# Altium project IMX6 DEV BOARD.PrjPcb (part 3 of 4)

## Sheet audio_codec.SchDoc
size A4; SheetNumber: 13; SheetTotal: 21
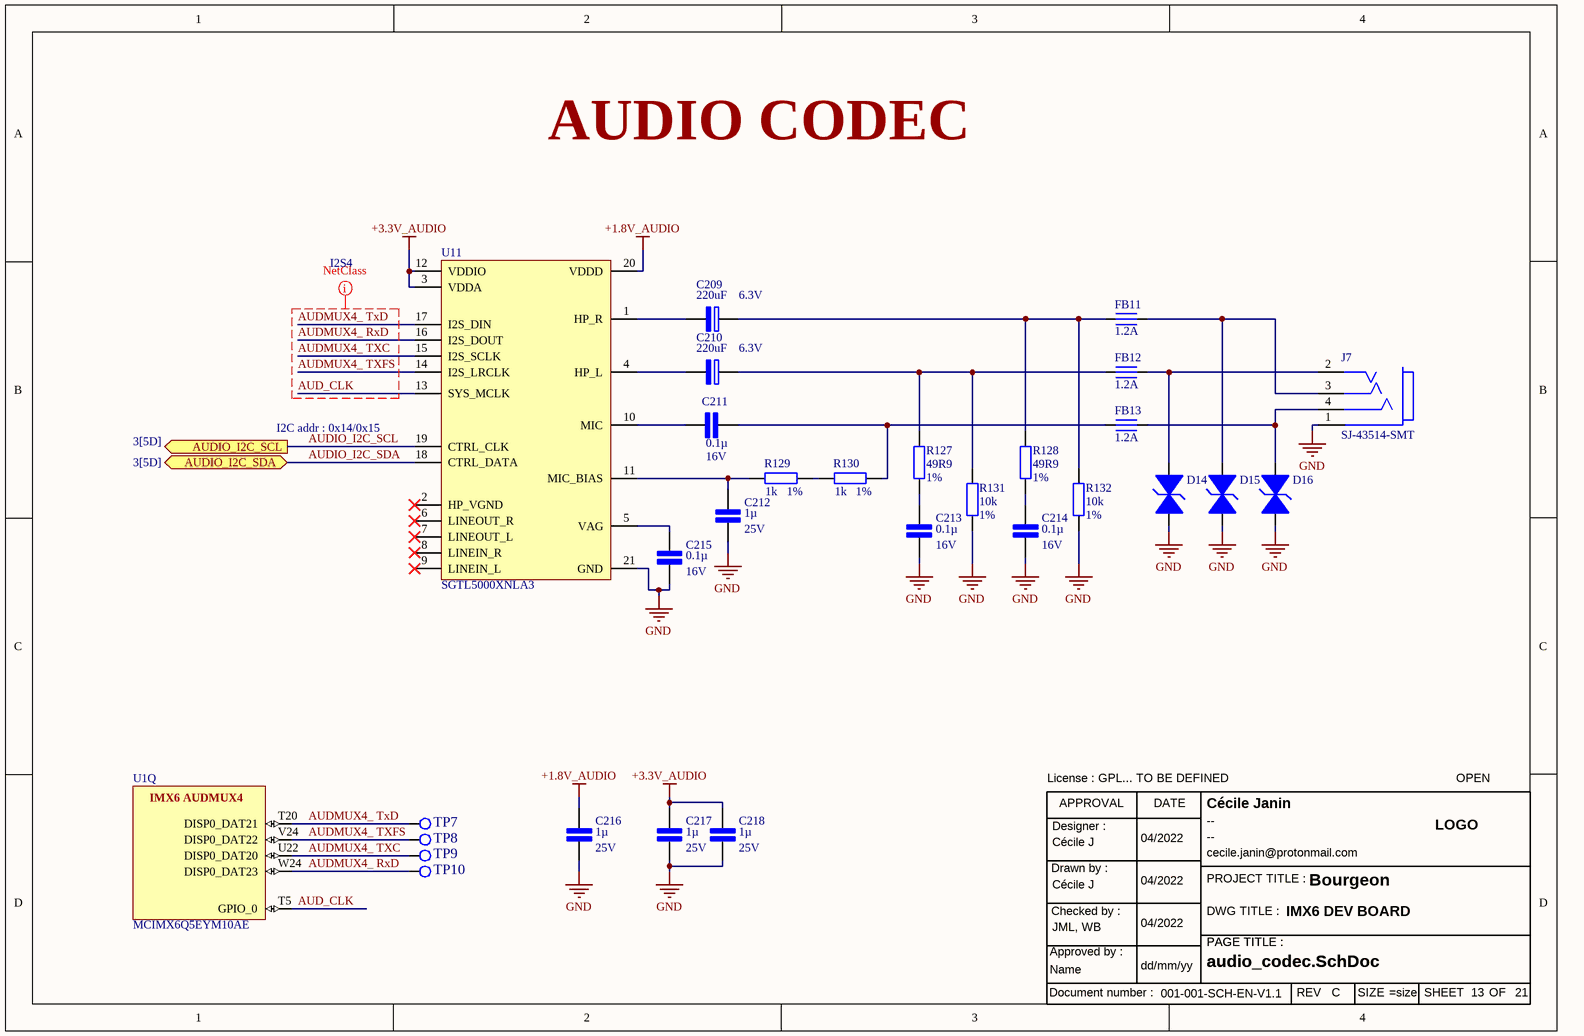
[diagram p15: audio_codec.SchDoc]

### Parts
C209  220uF  Rated Voltage (DC): 6.3V  [cap polymer wurth]
C210  220uF  Rated Voltage (DC): 6.3V  [cap polymer wurth]
C211  0.1µ  Tension du diélectrique: 16V  [Cap cer 0402/1005]
C212  1µ  Tension du diélectrique: 25V  [Cap cer 0402/1005]
C213  0.1µ  Tension du diélectrique: 16V  [Cap cer 0402/1005]
C214  0.1µ  Tension du diélectrique: 16V  [Cap cer 0402/1005]
C215  0.1µ  Tension du diélectrique: 16V  [Cap cer 0402/1005]
C216  1µ  Tension du diélectrique: 25V  [Cap cer 0402/1005]
C217  1µ  Tension du diélectrique: 25V  [Cap cer 0402/1005]
C218  1µ  Tension du diélectrique: 25V  [Cap cer 0402/1005]
D14  TVS 5V  [inductor 0402/1005]  (value not drawn)
D15  TVS 5V  [inductor 0402/1005]  (value not drawn)
D16  TVS 5V  [inductor 0402/1005]  (value not drawn)
FB11  1.2A  [inductor 0402/1005]
FB12  1.2A  [inductor 0402/1005]
FB13  1.2A  [inductor 0402/1005]
J7  SJ-43514-SMT  [Jack SJ-43514-SMT]
R127  49R9  pourcentage: 1%  [Res 0402/1005]
R128  49R9  pourcentage: 1%  [Res 0402/1005]
R129  1k  pourcentage: 1%  [Res 0402/1005]
R130  1k  pourcentage: 1%  [Res 0402/1005]
R131  10k  pourcentage: 1%  [Res 0402/1005]
R132  10k  pourcentage: 1%  [Res 0402/1005]
TB12  Title bloc ANSI modified  (value not drawn)
TP7  Test Point  [testpoint 1mm]  (value not drawn)
TP8  Test Point  [testpoint 1mm]  (value not drawn)
TP9  Test Point  [testpoint 1mm]  (value not drawn)
TP10  Test Point  [testpoint 1mm]  (value not drawn)
U1  MCIMX6Q5EYM10AE  [FRES-2197-01]  (part Q of 21)
U11  SGTL5000XNLA3  [QFN20]

### Ports
AUDIO_I2C_SCL (out, see 3[5D]), AUDIO_I2C_SDA (bidir, see 3[5D])

### Nets
+1.8V_AUDIO: C216.2 U11.20(VDDD)
+3.3V_AUDIO: C217.2 C218.2 U11.3(VDDA) U11.12(VDDIO)
GND: C212.1 C213.2 C214.2 C215.2 C216.1 C217.1 C218.1 D14.2 D15.2 D16.2 J7.1(sleeve) R131.1 R132.1 U11.21(GND)
AUD_CLK: U1.T5(GPIO_0) U11.13(SYS_MCLK)
AUDIO_I2C_SCL: U11.19(CTRL_CLK) ; port AUDIO_I2C_SCL
AUDIO_I2C_SDA: U11.18(CTRL_DATA) ; port AUDIO_I2C_SDA
AUDMUX4_ RxD: TP10.1(tp) U1.W24(DISP0_DAT23) U11.16(I2S_DOUT)
AUDMUX4_ TXC: TP9.1(tp) U1.U22(DISP0_DAT20) U11.15(I2S_SCLK)
AUDMUX4_ TxD: TP7.1(tp) U1.T20(DISP0_DAT21) U11.17(I2S_DIN)
AUDMUX4_ TXFS: TP8.1(tp) U1.V24(DISP0_DAT22) U11.14(I2S_LRCLK)
NetC209_1: C209.1(P) FB11.1 R128.2 R132.2
NetC209_2: C209.2(N) U11.1(HP_R)
NetC210_1: C210.1(P) FB12.1 R127.2 R131.2
NetC210_2: C210.2(N) U11.4(HP_L)
NetC211_1: C211.1 U11.10(MIC)
NetC211_2: C211.2 FB13.1 R130.2
NetC212_2: C212.2 R129.1 U11.11(MIC_BIAS)
NetC213_1: C213.1 R127.1
NetC214_1: C214.1 R128.1
NetC215_1: C215.1 U11.5(VAG)
NetD14_1: D14.1 FB12.2 J7.2(tip)
NetD15_1: D15.1 FB11.2 J7.3(ring_1)
NetD16_1: D16.1 FB13.2 J7.4(ring_2)
NetR129_2: R129.2 R130.1

Not connected (* = marked no-connect by the designer): U11 2(HP_VGND)* 6(LINEOUT_R)* 7(LINEOUT_L)* 8(LINEIN_R)* 9(LINEIN_L)*

### Layout directives
net class I2S4: AUD_CLK, AUDMUX4_ RxD, AUDMUX4_ TXC, AUDMUX4_ TxD, AUDMUX4_ TXFS

### Notes on the sheet
- AUDIO CODEC
- I2C addr : 0x14/0x15
- (in symbol IMX6Q5EYM10AE, part Q) IMX6 AUDMUX4
- (in symbol Title bloc ANSI) APPROVAL; DATE; Designer :; LOGO; Drawn by :; PROJECT TITLE :; Checked by :; DWG TITLE :; PAGE TITLE :; Approved by :; Document number :; REV; SIZE; SHEET; OF

### Library data of the parts
C209 C210 = cap 220µ 6.3V: WCAP-PHGP Aluminum Polymer Capacitor, H-Chip SMT, L7.3W4.3H1.9mm, 220uF, 6.3V 875015119006; Manufacturer: Wurth Elektronik; Capacitance Tolerance: +/-20%; Dissipation Factor: 6%; Endurance: 2000h; ESR: 15mOhm; Leakage Current: 138.6uA; Ripple Current: 5100mA; Technical Reference: PSE2917221M6R3DHCT2HT19; ComponentLink1Description: Manufacturer Link; ComponentLink1URL: https://www.we-online.com/redexpert/article/875015119006?ad; ComponentLink2Description: Datasheet; ComponentLink2URL: https://www.we-online.com/redexpert/spec/875015119006?ad; Category: Aluminum Polymer Capacitors; Match Code: WCAP-PHGP; Manufacturer Part Number: 875015119006; Mount: Surface Mount; Operating Temperature Max: 105°C; Operating Temperature Min: -55°C; Packaging: Tape and Reel; Length: 7.3mm; Width: 4.3mm; Height: 1.9mm; Capacitance: 220uF; Parameter 1: *
C211 C213-C215 = cap 0.1µ 16V: as C149 on sheet dram
C212 C216-C218 = cap 1µ 25V: cap cer 1µ 25V 10% X5R 0402; Diélectrique: X5R
D14-D16 = TVS suppressor 82357120050: 82357120050; ComponentLink1Description: New link; ComponentLink1URL: https://www.we-online.com/catalog/datasheet/82357120050.pdf
FB11-FB13 = Ferrite bead 0402: ferrite bead 1.2A 70mohm / 74269242111; ComponentLink1Description: New link; ComponentLink1URL: https://www.we-online.com/catalog/datasheet/74269242111.pdf
J7 = Audio Jack 3.5mm 4 pin: 4 pole audio Jack SJ-43514-SMT
R127 R128 = res 49R9 1%: res 49R9 ohm 1% 0402
R129 R130 = res 1k 1%: res 1k 1% 0402
R131 R132 = res 10k 1%: res 10k 1% 0402
TB12 = Title bloc ANSI
TP7-TP10 = Test Point: Test point 1mm diameter
U1 = IMX6Q5EYM10AE: as U1 on sheet dram; ComponentLink1Description: Manufacturer URL; ComponentLink2Description: Datasheet; DatasheetVersion: Rev. 2.3; ComponentLink3URL: http://cache.freescale.com/files/32bit/doc/data_sheet/IMX6DQCEC.pdf?fpsp=1&WT_TYPE=Data%20Sheets&WT_VENDOR=FREESCALE&WT_FILE_FORMAT=pdf&WT_ASSET=Documentation; ComponentLink1URL: http://www.freescale.com/; Packing: Tape and Reel; Temperature Range: -20 to 105 degC; ComponentLink2URL: http://cache.freescale.com/files/32bit/doc/data_sheet/IMX6DQCEC.pdf?fpsp=1&WT_TYPE=Data%20Sheets&WT_VENDOR=FREESCALE&WT_FILE_FORMAT=pdf&WT_ASSET=Documentation; ComponentLink3Description: Package Specification; PackageVersion: Rev. A; RoHS: TRUE; Quad/Dual CPU: i.MX 6Quad; Mounting Technology: Surface Mount; PackageReference: FCPBGA-624; PackageDescription: 624-pin Ball Grid Array Package, Body 21 x 21mm, Pitch 0.8mm
U11 = IC SGTL5000XNLA3: Audio codec

## Sheet mini_pcie.SchDoc
size A4; SheetNumber: 14; SheetTotal: 21
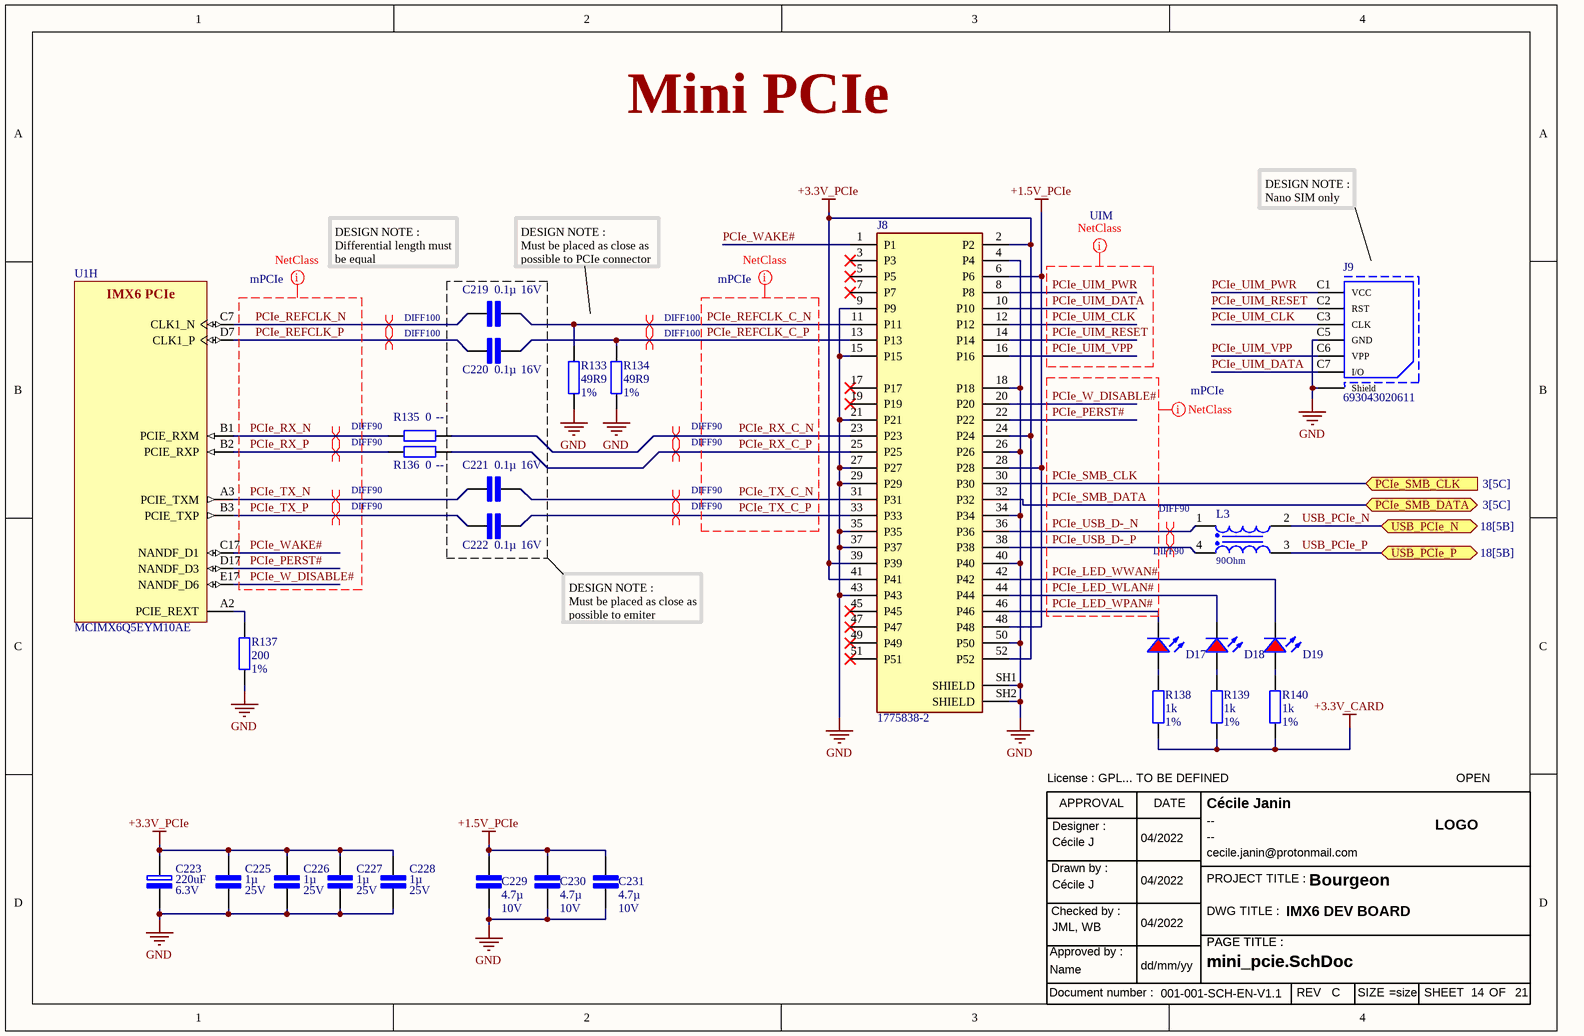
[diagram p16: mini_pcie.SchDoc]

### Parts
C219  0.1µ  Tension du diélectrique: 16V  [Cap cer 0402/1005]
C220  0.1µ  Tension du diélectrique: 16V  [Cap cer 0402/1005]
C221  0.1µ  Tension du diélectrique: 16V  [Cap cer 0402/1005]
C222  0.1µ  Tension du diélectrique: 16V  [Cap cer 0402/1005]
C223  220uF  Rated Voltage (DC): 6.3V  [cap polymer wurth]
C225  1µ  Tension du diélectrique: 25V  [Cap cer 0402/1005]
C226  1µ  Tension du diélectrique: 25V  [Cap cer 0402/1005]
C227  1µ  Tension du diélectrique: 25V  [Cap cer 0402/1005]
C228  1µ  Tension du diélectrique: 25V  [Cap cer 0402/1005]
C229  4.7µ  Tension du diélectrique: 10V  [Cap cer 0402/1005]
C230  4.7µ  Tension du diélectrique: 10V  [Cap cer 0402/1005]
C231  4.7µ  Tension du diélectrique: 10V  [Cap cer 0402/1005]
D17  Red, 2V, 120deg  [LED red 0603]  (value not drawn)
D18  Red, 2V, 120deg  [LED red 0603]  (value not drawn)
D19  Red, 2V, 120deg  [LED red 0603]  (value not drawn)
J8  1775838-2  [mini_PCIe_1775838-2]
J9  693043020611  [nano SIM 693043020611]
L3  90Ohm  [inductor coupled usb 0603]
R133  49R9  pourcentage: 1%  [Res 0402/1005]
R134  49R9  pourcentage: 1%  [Res 0402/1005]
R135  0  [Res 0402/1005]
R136  0  [Res 0402/1005]
R137  200  pourcentage: 1%  [Res 0402/1005]
R138  1k  pourcentage: 1%  [Res 0402/1005]
R139  1k  pourcentage: 1%  [Res 0402/1005]
R140  1k  pourcentage: 1%  [Res 0402/1005]
TB13  Title bloc ANSI modified  (value not drawn)
U1  MCIMX6Q5EYM10AE  [FRES-2197-01]  (part H of 21)

### Ports
PCIe_SMB_CLK (in, see 3[5C]), PCIe_SMB_DATA (bidir, see 3[5C]), USB_PCIe_N (bidir, see 18[5B]), USB_PCIe_P (bidir, see 18[5B])

### Nets
+1.5V_PCIe: C229.1 C230.1 C231.1 J8.6(P6) J8.28(P28) J8.48(P48)
+3.3V_CARD: R138.1 R139.1 R140.1
+3.3V_PCIe: C223.1(P) C225.1 C226.1 C227.1 C228.1 J8.2(P2) J8.24(P24) J8.39(P39) J8.41(P41) J8.52(P52)
GND: C223.2(N) C225.2 C226.2 C227.2 C228.2 C229.2 C230.2 C231.2 J8.4(P4) J8.9(P9) J8.15(P15) J8.18(P18) J8.21(P21) J8.26(P26) J8.27(P27) J8.29(P29) J8.34(P34) J8.35(P35) J8.37(P37) J8.40(P40) J8.43(P43) J8.50(P50) J8.SH1(SHIELD) J8.SH2(SHIELD) J9.C5(GND) J9.Shield R133.1 R134.1 R137.1
PCIe_LED_WLAN#: D18.1(K) J8.44(P44)
PCIe_LED_WPAN#: D17.1(K) J8.46(P46)
PCIe_LED_WWAN#: D19.1(K) J8.42(P42)
PCIe_PERST#: J8.22(P22) U1.D17(NANDF_D3)
PCIe_REFCLK_C_N: C219.2 J8.11(P11) R133.2
PCIe_REFCLK_C_P: C220.2 J8.13(P13) R134.2
PCIe_REFCLK_N: C219.1 U1.C7(CLK1_N)
PCIe_REFCLK_P: C220.1 U1.D7(CLK1_P)
PCIe_RX_C_N: J8.23(P23) R135.2
PCIe_RX_C_P: J8.25(P25) R136.2
PCIe_RX_N: R135.1 U1.B1(PCIE_RXM)
PCIe_RX_P: R136.1 U1.B2(PCIE_RXP)
PCIe_SMB_CLK: J8.30(P30) ; port PCIe_SMB_CLK
PCIe_SMB_DATA: J8.32(P32) ; port PCIe_SMB_DATA
PCIe_TX_C_N: C221.2 J8.31(P31)
PCIe_TX_C_P: C222.2 J8.33(P33)
PCIe_TX_N: C221.1 U1.A3(PCIE_TXM)
PCIe_TX_P: C222.1 U1.B3(PCIE_TXP)
PCIe_UIM_CLK: J8.12(P12) J9.C3(CLK)
PCIe_UIM_DATA: J8.10(P10) J9.C7(I/O)
PCIe_UIM_PWR: J8.8(P8) J9.C1(VCC)
PCIe_UIM_RESET: J8.14(P14) J9.C2(RST)
PCIe_UIM_VPP: J8.16(P16) J9.C6(VPP)
PCIe_USB_D-_N: J8.36(P36) L3.1
PCIe_USB_D-_P: J8.38(P38) L3.4
PCIe_W_DISABLE#: J8.20(P20) U1.E17(NANDF_D6)
PCIe_WAKE#: J8.1(P1) U1.C17(NANDF_D1)
USB_PCIe_N: L3.2 ; port USB_PCIe_N
USB_PCIe_P: L3.3 ; port USB_PCIe_P
NetD17_2: D17.2(A) R138.2
NetD18_2: D18.2(A) R139.2
NetD19_2: D19.2(A) R140.2
NetR137_2: R137.2 U1.A2(PCIE_REXT)

Not connected (* = marked no-connect by the designer): J8 3(P3)* 5(P5)* 7(P7)* 17(P17)* 19(P19)* 45(P45)* 47(P47)* 49(P49)* 51(P51)*

### Layout directives
net class mPCIe: PCIe_LED_WLAN#, PCIe_LED_WPAN#, PCIe_LED_WWAN#, PCIe_PERST#, PCIe_REFCLK_C_N, PCIe_REFCLK_C_P, PCIe_REFCLK_N, PCIe_REFCLK_P, PCIe_RX_C_N, PCIe_RX_C_P, PCIe_RX_N, PCIe_RX_P, PCIe_SMB_CLK, PCIe_SMB_DATA, PCIe_TX_C_N, PCIe_TX_C_P, PCIe_TX_N, PCIe_TX_P, PCIe_USB_D-_N, PCIe_USB_D-_P, PCIe_W_DISABLE#, PCIe_WAKE#
net class UIM: PCIe_UIM_CLK, PCIe_UIM_DATA, PCIe_UIM_PWR, PCIe_UIM_RESET, PCIe_UIM_VPP
differential pair; differential pair class DIFF100: PCIe_REFCLK_C_N, PCIe_REFCLK_C_P, PCIe_REFCLK_N, PCIe_REFCLK_P
differential pair; differential pair class DIFF90: PCIe_RX_C_N, PCIe_RX_C_P, PCIe_RX_N, PCIe_RX_P, PCIe_TX_C_N, PCIe_TX_C_P, PCIe_TX_N, PCIe_TX_P, PCIe_USB_D-_N, PCIe_USB_D-_P

### Notes on the sheet
- Mini PCIe
- DESIGN NOTE :
  Nano SIM only
- DESIGN NOTE :
  Differential length must be equal
- (near C219) DESIGN NOTE :
  Must be placed as close as possible to PCIe connector
- DESIGN NOTE :
  Must be placed as close as possible to emiter
- (in symbol IMX6Q5EYM10AE, part H) IMX6 PCIe
- (in symbol Title bloc ANSI) APPROVAL; DATE; Designer :; LOGO; Drawn by :; PROJECT TITLE :; Checked by :; DWG TITLE :; PAGE TITLE :; Approved by :; Document number :; REV; SIZE; SHEET; OF

### Library data of the parts
C219-C222 = cap 0.1µ 16V: as C149 on sheet dram
C223 = cap 220µ 6.3V: as C209 on sheet audio_codec; ComponentLink1Description: Manufacturer Link; ComponentLink1URL: https://www.we-online.com/redexpert/article/875015119006?ad; ComponentLink2Description: Datasheet; ComponentLink2URL: https://www.we-online.com/redexpert/spec/875015119006?ad; Category: Aluminum Polymer Capacitors; Match Code: WCAP-PHGP; Manufacturer Part Number: 875015119006; Mount: Surface Mount; Operating Temperature Max: 105°C; Operating Temperature Min: -55°C; Packaging: Tape and Reel; Length: 7.3mm; Width: 4.3mm; Height: 1.9mm; Capacitance: 220uF; Parameter 1: *
C225-C228 = cap 1µ 25V: cap cer 1µ 25V 10% X5R 0402; Diélectrique: X5R
C229-C231 = cap 4.7µ 10V: cap cer 4.7µ 10V 10% X7R 0402; Diélectrique: X7R
D17-D19 = LED Red 0603: as D5 on sheet ethernet; ComponentLink1URL: http://www.we-online.de; ComponentLink2Description: Datasheet; ComponentLink2URL: https://katalog.we-online.com/led/datasheet/150060RS73220.pdf; Part Number: 150060RS73220; Published Date: July 2019; Publisher: Wurth Elektronik; Size: 0603; Viewing Angle: 120deg; Packaging: Tape and Reel; Emitting Color: Red; Mounting Technology: SMT; Forward Voltage: 2V; Operating Temperature: -40 to +85degC
J8 = mini_PCIe_1775838-2: mini pcie connector
J9 = Nano SIM
L3 = inductor coupled USB: WE-CNSW SMT Common Mode Line Filter, size 0603, 90Ohm, 0.55A, 50V; Manufacturer Part Number: 744230900; Manufacturer: Wurth Elektronik; DC Resistance max.: 0.145Ohm; Impedance Test Condition: 100MHz; Insulation Test Voltage: 125VAC; Winding Style: bifiliar; ComponentLink1Description: Manufacturer; ComponentLink1URL: http://www.we-online.de; ComponentLink2Description: Datasheet; ComponentLink2URL: https://www.we-online.com/catalog/datasheet/744230900.pdf; Operating Temperature: -40 to +125degC; Packaging: Tape and Reel; Published Date: April 2020; Rated Current: 0.55A; Size: 0603; Impedance: 90Ohm; Rated Voltage: 50V; Mounting Technology: SMT
R133 R134 = res 49R9 1%: res 49R9 ohm 1% 0402
R135 R136 = res 0Ohm small: res 0402; pourcentage: --
R137 = res 200 1%: res 200 1% 0402
R138-R140 = res 1k 1%: res 1k 1% 0402
TB13 = Title bloc ANSI
U1 = IMX6Q5EYM10AE: as U1 on sheet dram; ComponentLink1Description: Manufacturer URL; ComponentLink2Description: Datasheet; DatasheetVersion: Rev. 2.3; ComponentLink3URL: http://cache.freescale.com/files/32bit/doc/data_sheet/IMX6DQCEC.pdf?fpsp=1&WT_TYPE=Data%20Sheets&WT_VENDOR=FREESCALE&WT_FILE_FORMAT=pdf&WT_ASSET=Documentation; ComponentLink1URL: http://www.freescale.com/; Packing: Tape and Reel; Temperature Range: -20 to 105 degC; ComponentLink2URL: http://cache.freescale.com/files/32bit/doc/data_sheet/IMX6DQCEC.pdf?fpsp=1&WT_TYPE=Data%20Sheets&WT_VENDOR=FREESCALE&WT_FILE_FORMAT=pdf&WT_ASSET=Documentation; ComponentLink3Description: Package Specification; PackageVersion: Rev. A; RoHS: TRUE; Quad/Dual CPU: i.MX 6Quad; Mounting Technology: Surface Mount; PackageReference: FCPBGA-624; PackageDescription: 624-pin Ball Grid Array Package, Body 21 x 21mm, Pitch 0.8mm

## Sheet sata_m2.SchDoc
size A4; SheetNumber: 15; SheetTotal: 21
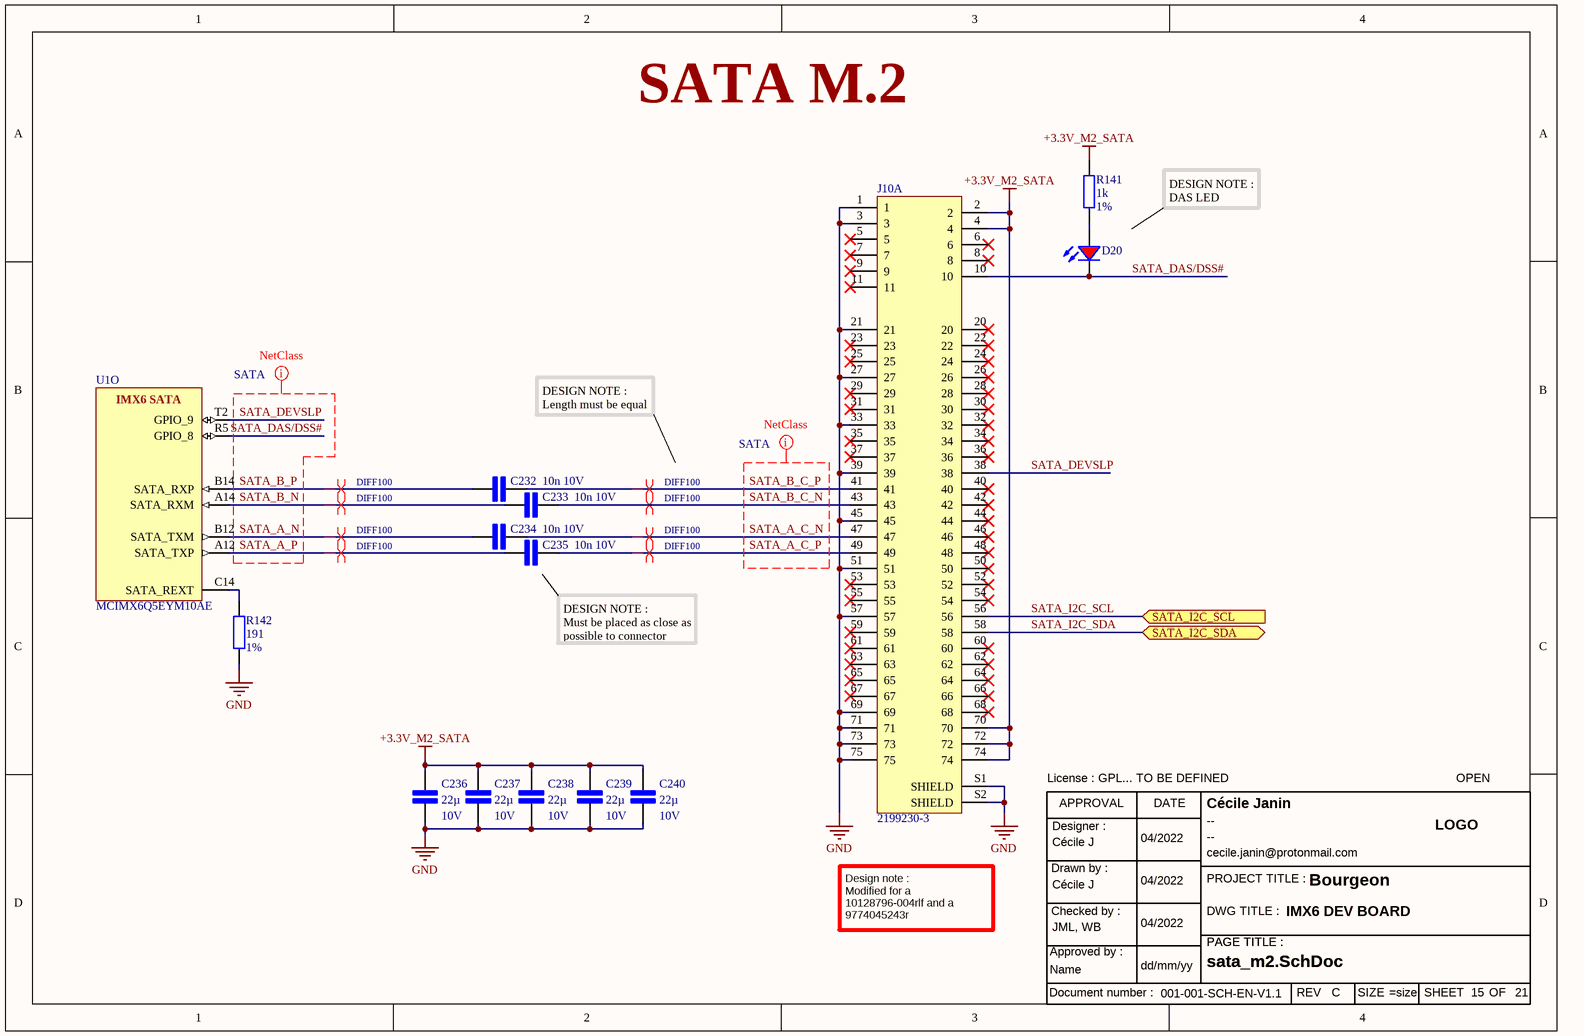
[diagram p17: sata_m2.SchDoc]

### Parts
C232  10n  Tension du diélectrique: 10V  [CAP CER 0201/0603]
C233  10n  Tension du diélectrique: 10V  [CAP CER 0201/0603]
C234  10n  Tension du diélectrique: 10V  [CAP CER 0201/0603]
C235  10n  Tension du diélectrique: 10V  [CAP CER 0201/0603]
C236  22µ  Tension du diélectrique: 10V  [Cap cer 0603/4608]
C237  22µ  Tension du diélectrique: 10V  [Cap cer 0603/4608]
C238  22µ  Tension du diélectrique: 10V  [Cap cer 0603/4608]
C239  22µ  Tension du diélectrique: 10V  [Cap cer 0603/4608]
C240  22µ  Tension du diélectrique: 10V  [Cap cer 0603/4608]
D20  Red, 2V, 120deg  [LED red 0603]  (value not drawn)
J10  2199230-3  [SATA_M2_ 2199230-3]  (part A of 2)
R141  1k  pourcentage: 1%  [Res 0402/1005]
R142  191  pourcentage: 1%  [Res 0402/1005]
TB14  Title bloc ANSI modified  (value not drawn)
U1  MCIMX6Q5EYM10AE  [FRES-2197-01]  (part O of 21)

### Ports
SATA_I2C_SCL (in), SATA_I2C_SDA (bidir)

### Nets
+3.3V_M2_SATA: C236.1 C237.1 C238.1 C239.1 C240.1 J10.2 J10.4 J10.70 J10.72 J10.74 R141.2
GND: C236.2 C237.2 C238.2 C239.2 C240.2 J10.1 J10.3 J10.21 J10.27 J10.33 J10.39 J10.45 J10.51 J10.57 J10.69 J10.71 J10.73 J10.75 J10.S1(SHIELD) J10.S2(SHIELD) R142.1
SATA_A_C_N: C234.2 J10.47
SATA_A_C_P: C235.2 J10.49
SATA_A_N: C234.1 U1.B12(SATA_TXM)
SATA_A_P: C235.1 U1.A12(SATA_TXP)
SATA_B_C_N: C233.2 J10.43
SATA_B_C_P: C232.2 J10.41
SATA_B_N: C233.1 U1.A14(SATA_RXM)
SATA_B_P: C232.1 U1.B14(SATA_RXP)
SATA_DAS/DSS#: D20.1(K) J10.10 U1.R5(GPIO_8)
SATA_DEVSLP: J10.38 U1.T2(GPIO_9)
SATA_I2C_SCL: J10.56 ; port SATA_I2C_SCL
SATA_I2C_SDA: J10.58 ; port SATA_I2C_SDA
NetD20_2: D20.2(A) R141.1
NetR142_2: R142.2 U1.C14(SATA_REXT)

Not connected (* = marked no-connect by the designer): J10 5* 6* 7* 8* 9* 11* 20* 22* 23* 24* 25* 26* 28* 29* 30* 31* 32* 34* 35* 36* 37* 40* 42* 44* 46* 48* 50* 52* 53* 54* 55* 59* 60* 61* 62* 63* 64* 65* 66* 67* 68*

### Layout directives
differential pair; differential pair class DIFF100: SATA_A_C_N, SATA_A_C_P, SATA_A_N, SATA_A_P, SATA_B_C_N, SATA_B_C_P, SATA_B_N, SATA_B_P
net class SATA: SATA_A_C_N, SATA_A_C_P, SATA_A_N, SATA_A_P, SATA_B_C_N, SATA_B_C_P, SATA_B_N, SATA_B_P, SATA_DEVSLP

### Notes on the sheet
- SATA M.2
- DESIGN NOTE :
  DAS LED
- DESIGN NOTE :
  Length must be equal
- DESIGN NOTE :
  Must be placed as close as possible to connector
- Design note :
  Modified for a 10128796-004rlf and a 9774045243r
- (in symbol IMX6Q5EYM10AE, part O) IMX6 SATA
- (in symbol Title bloc ANSI) APPROVAL; DATE; Designer :; LOGO; Drawn by :; PROJECT TITLE :; Checked by :; DWG TITLE :; PAGE TITLE :; Approved by :; Document number :; REV; SIZE; SHEET; OF

### Library data of the parts
C232-C235 = cap 10n 10V: cap ceramique 10n 10V 10% 0201; Diélectrique: X5R
C236-C240 = cap 22µ 10V: cap cer 22µ 10V 10% X5R 0603; Diélectrique: X5R
D20 = LED Red 0603: as D5 on sheet ethernet; ComponentLink1URL: http://www.we-online.de; ComponentLink2Description: Datasheet; ComponentLink2URL: https://katalog.we-online.com/led/datasheet/150060RS73220.pdf; Part Number: 150060RS73220; Published Date: July 2019; Publisher: Wurth Elektronik; Size: 0603; Viewing Angle: 120deg; Packaging: Tape and Reel; Emitting Color: Red; Mounting Technology: SMT; Forward Voltage: 2V; Operating Temperature: -40 to +85degC
J10 = SATA_M.2_2199230-3 / multi interface: Combined component with SATA M.2 and external card connector (M.2 format too) / ref : / 2199230-4 / 2199230-3
R141 = res 1k 1%: res 1k 1% 0402
R142 = res 191 1%: res 191 ohm 1% 0402
TB14 = Title bloc ANSI
U1 = IMX6Q5EYM10AE: as U1 on sheet dram; ComponentLink1Description: Manufacturer URL; ComponentLink2Description: Datasheet; DatasheetVersion: Rev. 2.3; ComponentLink3URL: http://cache.freescale.com/files/32bit/doc/data_sheet/IMX6DQCEC.pdf?fpsp=1&WT_TYPE=Data%20Sheets&WT_VENDOR=FREESCALE&WT_FILE_FORMAT=pdf&WT_ASSET=Documentation; ComponentLink1URL: http://www.freescale.com/; Packing: Tape and Reel; Temperature Range: -20 to 105 degC; ComponentLink2URL: http://cache.freescale.com/files/32bit/doc/data_sheet/IMX6DQCEC.pdf?fpsp=1&WT_TYPE=Data%20Sheets&WT_VENDOR=FREESCALE&WT_FILE_FORMAT=pdf&WT_ASSET=Documentation; ComponentLink3Description: Package Specification; PackageVersion: Rev. A; RoHS: TRUE; Quad/Dual CPU: i.MX 6Quad; Mounting Technology: Surface Mount; PackageReference: FCPBGA-624; PackageDescription: 624-pin Ball Grid Array Package, Body 21 x 21mm, Pitch 0.8mm